# Altium schematic sheet Sheet_CL-SP-01.SchDoc: SEPIC POWER
size A4; Author: Canaan Lv; DocumentNumber: CL-SP-01; Revision: v1.0
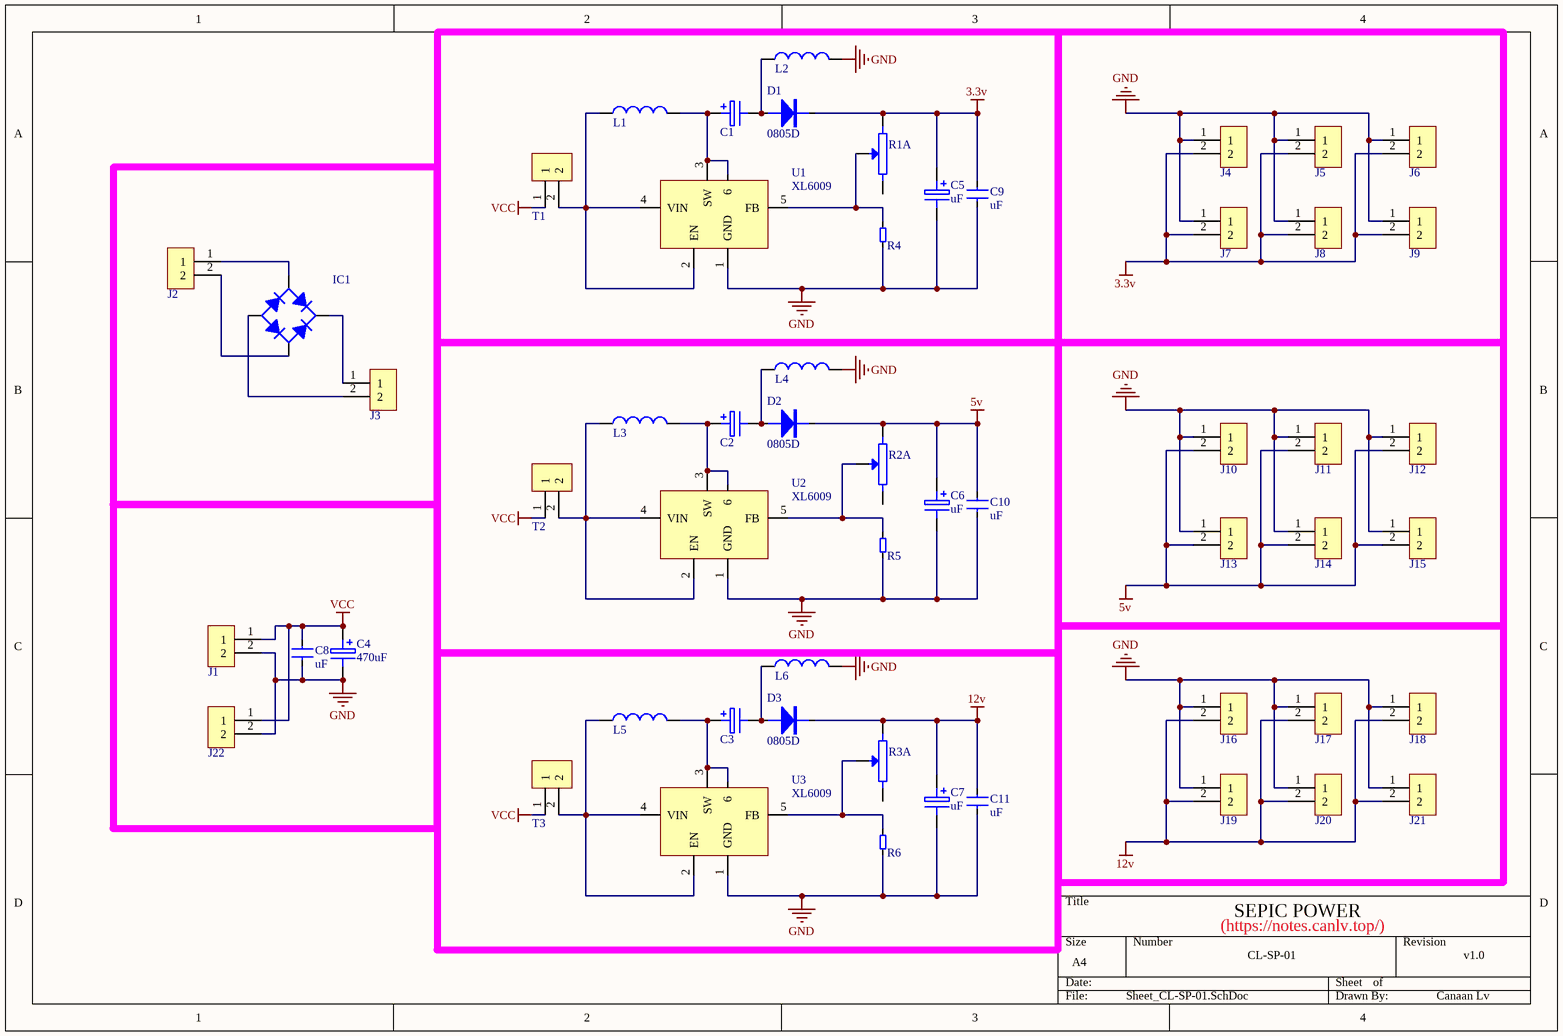
[diagram p0: Sheet_CL-SP-01.SchDoc]

## Parts
C1  uF  [CZ0.60/50V47U]  (value not drawn)
C2  uF  [CZ0.60/50V47U]  (value not drawn)
C3  uF  [CZ0.60/50V47U]  (value not drawn)
C4  470uF  [CZ1.00/35V470uF]
C5  uF  [CZ0.65/25V100U]
C6  uF  [CZ0.65/25V100U]
C7  uF  [CZ0.65/25V100U]
C8  uF  [C1206]
C9  uF  [C1206]
C10  uF  [C1206]
C11  uF  [C1206]
D1  0805D  [0805D]
D2  0805D  [0805D]
D3  0805D  [0805D]
IC1  (no value)  [整流桥3]
J1  SIP-2  [2.54XH接插件2P]  (value not drawn)
J2  SIP-2  [2.54XH接插件2P]  (value not drawn)
J3  SIP-2  [2.54XH接插件2P]  (value not drawn)
J4  SIP-2  [2.54XH接插件2P]  (value not drawn)
J5  SIP-2  [2.54XH接插件2P]  (value not drawn)
J6  SIP-2  [2.54XH接插件2P]  (value not drawn)
J7  SIP-2  [2.54XH接插件2P]  (value not drawn)
J8  SIP-2  [2.54XH接插件2P]  (value not drawn)
J9  SIP-2  [2.54XH接插件2P]  (value not drawn)
J10  SIP-2  [2.54XH接插件2P]  (value not drawn)
J11  SIP-2  [2.54XH接插件2P]  (value not drawn)
J12  SIP-2  [2.54XH接插件2P]  (value not drawn)
J13  SIP-2  [2.54XH接插件2P]  (value not drawn)
J14  SIP-2  [2.54XH接插件2P]  (value not drawn)
J15  SIP-2  [2.54XH接插件2P]  (value not drawn)
J16  SIP-2  [2.54XH接插件2P]  (value not drawn)
J17  SIP-2  [2.54XH接插件2P]  (value not drawn)
J18  SIP-2  [2.54XH接插件2P]  (value not drawn)
J19  SIP-2  [2.54XH接插件2P]  (value not drawn)
J20  SIP-2  [2.54XH接插件2P]  (value not drawn)
J21  SIP-2  [2.54XH接插件2P]  (value not drawn)
J22  SIP-2  [2.54XH接插件2P]  (value not drawn)
L1  贴片电感  [L5X5]  (value not drawn)
L2  贴片电感  [L5X5]  (value not drawn)
L3  贴片电感  [L5X5]  (value not drawn)
L4  贴片电感  [L5X5]  (value not drawn)
L5  贴片电感  [L5X5]  (value not drawn)
L6  贴片电感  [L5X5]  (value not drawn)
R1  主控  [ADJ-3296-1]  (value not drawn)  (part A of 2)
R2  主控  [ADJ-3296-1]  (value not drawn)  (part A of 2)
R3  主控  [ADJ-3296-1]  (value not drawn)  (part A of 2)
R4  R贴片电阻  [R1206]  (value not drawn)
R5  R贴片电阻  [R1206]  (value not drawn)
R6  R贴片电阻  [R1206]  (value not drawn)
T1  SIP-2  [2.54排针1X2]  (value not drawn)
T2  SIP-2  [2.54排针1X2]  (value not drawn)
T3  SIP-2  [2.54排针1X2]  (value not drawn)
U1  XL6009  [TO-263-5]
U2  XL6009  [TO-263-5]
U3  XL6009  [TO-263-5]

## Nets
3.3v: C5.1 C9.1 D1.K J4.2 J5.2 J6.2 J7.2 J8.2 J9.2 R1.1
5v: C6.1 C10.1 D2.K J10.2 J11.2 J12.2 J13.2 J14.2 J15.2 R2.1
12v: C7.1 C11.1 D3.K J16.2 J17.2 J18.2 J19.2 J20.2 J21.2 R3.1
GND: C4.2 C5.2 C6.2 C7.2 C8.2 C9.2 C10.2 C11.2 J1.2 J4.1 J5.1 J6.1 J7.1 J8.1 J9.1 J10.1 J11.1 J12.1 J13.1 J14.1 J15.1 J16.1 J17.1 J18.1 J19.1 J20.1 J21.1 J22.2 L2.2 L4.2 L6.2 R4.1 R5.1 R6.1 U1.1(GND) U2.1(GND) U3.1(GND)
VCC: C4.1 C8.1 J1.1 J22.1 T1.1 T2.1 T3.1
NetC1_1: C1.1 L1.2 U1.3(SW) U1.6
NetC1_2: C1.2 D1.A L2.1
NetC2_1: C2.1 L3.2 U2.3(SW) U2.6
NetC2_2: C2.2 D2.A L4.1
NetC3_1: C3.1 L5.2 U3.3(SW) U3.6
NetC3_2: C3.2 D3.A L6.1
NetIC1_1: IC1.1(+) J3.1
NetIC1_2: IC1.2(C) J2.1
NetIC1_3: IC1.3(C) J2.2
NetIC1_4: IC1.4(-) J3.2
NetL1_1: L1.1 T1.2 U1.2(EN) U1.4(VIN)
NetL3_1: L3.1 T2.2 U2.2(EN) U2.4(VIN)
NetL5_1: L5.1 T3.2 U3.2(EN) U3.4(VIN)
NetR1_2: R1.2 R4.2 U1.5(FB)
NetR2_2: R2.2 R5.2 U2.5(FB)
NetR3_2: R3.2 R6.2 U3.5(FB)

Not connected (* = marked no-connect by the designer): R1 3; R2 3; R3 3

## Notes on the sheet
- (https://notes.canlv.top/)

## Library data of the parts
C1-C7 = C直插电容
C8-C11 = C贴片电容
IC1 = 整流桥1
R1-R3 = R电位器
U1-U3 = XL6009: Switching Power